# Altium schematic sheet HV Sense.SchDoc
size A4; SheetNumber: 7; SheetTotal: 11
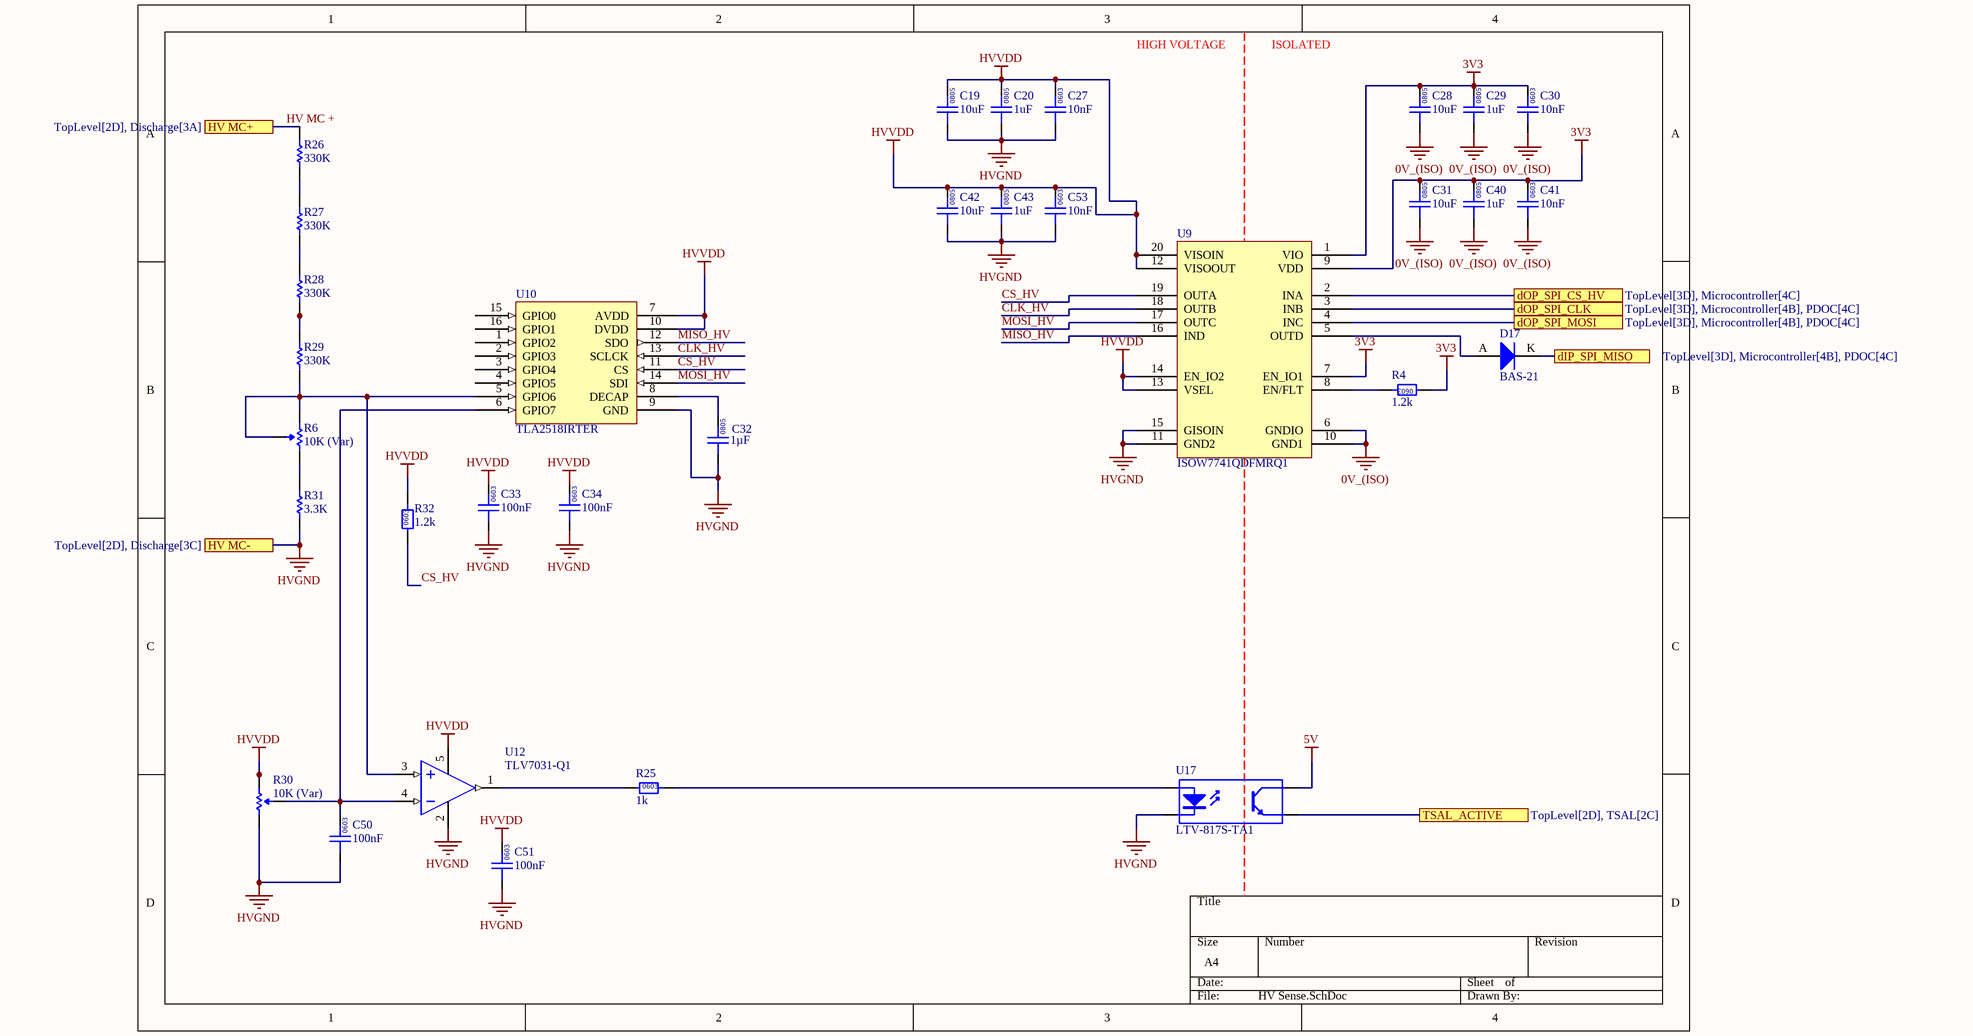
[diagram p0: HV Sense.SchDoc]

## Parts
C19  10uF  [GCM21BR71H105KA03L-Footprint-1]
C20  1uF  [GCM21BR71H105KA03L-Footprint-1]
C27  10nF  [0603 Capacitor]
C28  10uF  [GCM21BR71H105KA03L-Footprint-1]
C29  1uF  [GCM21BR71H105KA03L-Footprint-1]
C30  10nF  [0603 Capacitor]
C31  10uF  [GCM21BR71H105KA03L-Footprint-1]
C32  1µF  [0805]
C33  100nF  [0603]
C34  100nF  [0603]
C40  1uF  [GCM21BR71H105KA03L-Footprint-1]
C41  10nF  [0603 Capacitor]
C42  10uF  [GCM21BR71H105KA03L-Footprint-1]
C43  1uF  [GCM21BR71H105KA03L-Footprint-1]
C50  100nF  [0603]
C51  100nF  [0603]
C53  10nF  [0603 Capacitor]
D17  BAS-21  [NEXPERIA_SOT23]
R4  1.2k  [0603]
R6  10K (Var)  [B 3296]
R25  1k  [0603]
R26  330K  [VB 0207]
R27  330K  [VB 0207]
R28  330K  [VB 0207]
R29  330K  [VB 0207]
R30  10K (Var)  [B 3296]
R31  3.3K  [VB 0207]
R32  1.2k  [0603]
U9  ISOW7741QDFMRQ1  [TI-SOIC-20]
U10  TLA2518IRTER  [QFN50P300X300X80_HS-17N]
U12  TLV7031-Q1  [TI SOT-23-5]
U17  LTV-817S-TA1  [ON 4-SMD]

## Ports
dIP_SPI_MISO (see TopLevel[3D], Microcontroller[4B], PDOC[4C]), dOP_SPI_CLK (see TopLevel[3D], Microcontroller[4B], PDOC[4C]), dOP_SPI_CS_HV (see TopLevel[3D], Microcontroller[4C]), dOP_SPI_MOSI (see TopLevel[3D], Microcontroller[4B], PDOC[4C]), HV MC+ (see TopLevel[2D], Discharge[3A]), HV MC- (see TopLevel[2D], Discharge[3C]), TSAL_ACTIVE (see TopLevel[2D], TSAL[2C])

## Nets
0V_(ISO): C28.1 C29.1 C30.1 C31.1 C40.1 C41.1 U9.6(GNDIO) U9.10(GND1)
3V3: C28.2 C29.2 C30.2 C31.2 C40.2 C41.2 R4.1 U9.1(VIO) U9.7(EN_IO1) U9.9(VDD)
5V: U17.4(C)
HVGND: C19.1 C20.1 C27.1 C32.1 C33.1 C34.1 C42.1 C43.1 C50.1 C51.1 C53.1 R30.3(CW) R31.1 U9.11(GND2) U9.15(GISOIN) U10.9(GND) U12.2(V-) U17.2(K) ; port HV MC-
HVVDD: C19.2 C20.2 C27.2 C33.2 C34.2 C42.2 C43.2 C51.2 C53.2 R30.1(CCW) R32.2 U9.12(VISOOUT) U9.13(VSEL) U9.14(EN_IO2) U9.20(VISOIN) U10.7(AVDD) U10.10(DVDD) U12.5(Vcc)
CLK_HV: U9.18(OUTB) U10.13(SCLCK)
CS_HV: R32.1 U9.19(OUTA) U10.11(CS)
dIP_SPI_MISO: D17.K ; port dIP_SPI_MISO
dOP_SPI_CLK: U9.3(INB) ; port dOP_SPI_CLK
dOP_SPI_CS_HV: U9.2(INA) ; port dOP_SPI_CS_HV
dOP_SPI_MOSI: U9.4(INC) ; port dOP_SPI_MOSI
HV MC +: R26.2 ; port HV MC+
MISO_HV: U9.16(IND) U10.12(SDO)
MOSI_HV: U9.17(OUTC) U10.14(SDI)
TSAL_ACTIVE: U17.3(E) ; port TSAL_ACTIVE
NetC32_2: C32.2 U10.8(DECAP)
NetC50_2: C50.2 R30.2(Wiper) U10.6(GPIO7) U12.4(IN-)
NetD17_A: D17.A U9.5(OUTD)
NetR4_2: R4.2 U9.8(EN/FLT)
NetR6_1: R6.1(CCW) R31.2
NetR6_2: R6.2(Wiper) R6.3(CW) R29.1 U10.5(GPIO6) U12.3(IN+)
NetR25_1: R25.1 U12.1(OUT)
NetR25_2: R25.2 U17.1(A)
NetR26_1: R26.1 R27.2
NetR27_1: R27.1 R28.2
NetR28_1: R28.1 R29.2

Not connected (* = marked no-connect by the designer): U10 1(GPIO2) 2(GPIO3) 3(GPIO4) 4(GPIO5) 15(GPIO0) 16(GPIO1)

## Notes on the sheet
- HIGH VOLTAGE
- ISOLATED
- (in symbol CMP-102-000028-7) 0603
- (in symbol CMP-102-000033-3) 0805
- (in symbol CMP-102-000034-2) 0805
- (in symbol GCM21BR71H105KA03L) 0805
- (in symbol GCM188L81H104KA57D) 0603
- (in symbol RC0603FR-071KL) 0603
- (in symbol RC0603JR-071K2L) 0603

## Library data of the parts
C19 C28 C31 C42 = CMP-102-000034-2: Ceramic Capacitor, Multilayer, Ceramic, 35V, 10% +Tol, 10% -Tol, X5R, 15% TC, 10uF, Surface Mount, 0805; Part Number: GRM21BR6YA106KE43L; Value: 10µF; Material: X7R; Tolerance: 10%; Rated Voltage: 35V; Digikey Link: https://www.digikey.com.au/en/products/detail/murata-electronics/GRM21BR6YA106KE43L/5027598?s=N4IgTCBcDaIOICUCyYCMAhBA2AmgQVQAYsBpAUQBYBmAGQAIQBdAXyA
C20 C29 C40 C43 = CMP-102-000033-3: Ceramic Capacitor, Multilayer, Ceramic, 50V, 10% +Tol, 10% -Tol, X7R, 15% TC, 1uF, Surface Mount, 0805; Part Number: GCM21BR71H105KA03L; Value: 1µF; Rated Voltage: 50V; Digikey Link: https://www.digikey.com.au/en/products/detail/murata-electronics/GCM21BR71H105KA03L/4903984?s=N4IgTCBcDaIOIGECyYCMAhASgdlQCVQAYBWAaQEFCBmAGRAF0BfIA; Tolerance: 10%; Material: X7R
C27 C30 C41 C53 = CMP-102-000028-7: Ceramic Capacitor, Multilayer, Ceramic, 50V, 5% +Tol, 5% -Tol, C0G, 30ppm/Cel TC, 0.01uF, Surface Mount, 0603; Part Number: GCM1885C1H103JA16D; Value: 10nF; Material: C0G; Rated Voltage: 50V; Tolerance: 5%; Digikey Link: https://www.digikey.com.au/en/products/detail/murata-electronics/GCM1885C1H103JA16D/13401923?s=N4IgTCBcDaIOIGECyBGAHGgrAlAJFADAMwBSAgigGwAiIAugL5A
C32 = GCM21BR71H105KA03L: Manufacturer: muRata; Rated Voltage: 50V; Tolerance: ±10%; Material: MLCC; Temperature Rating: X7R; Part Number: GCM21BR71H105KA03L; Value: 1µF; Digikey Part Number: 490-10675-1-ND
C33 C34 C50 C51 = GCM188L81H104KA57D: Manufacturer: muRata; Rated Voltage: 50V; Tolerance: ±10%; Material: MLCC; Temperature Rating: X8L; Part Number: GCM188L81H104KA57D; Value: 100nF; Digikey Part Number: 490-6049-1-ND
D17 = BAS-21: Manufacturer: Nexperia USA Inc.; Forward Voltage: 1.0V; Breakdown Voltage: 250V; Rated Power: 250mW; Part Number: BAS-21
R4 R32 = RC0603JR-071K2L: Manufacturer: YAGEO; Tolerance: 0.01; Rated Power: 0.1W; Part Number: RC0603JR-071K2L; Value: 1.2k; Material: FR-07; Digikey Part Number: 311-1.2KGRCT-ND
R6 R30 = 3296W-1-103LF: Manufacturer: Bournes Inc; Tolerance: 0.1; Rated Power: 0.5W; Part Number: 3296W-1-103LF; Value: 10K (Var); Digikey Part Number: 3296W-103LF-ND
R25 = RC0603FR-071KL: Manufacturer: YAGEO; Tolerance: 0.01; Rated Power: 0.1W; Part Number: RC0603FR-071KL; Value: 1k; Digikey Part Number: 311-1.00KHRCT-ND; Material: FR-07
R26-R29 = MMB02070C3303FB200: Manufacturer: Vishay Beyschlag; Tolerance: 0.01; Rated Power: 1W; Part Number: MMB02070C3303FB200; Value: 330K; Digikey Part Number: MMB-330KBCT-ND
R31 = MMB02070C3301FB200: Manufacturer: Vishay Beyschlag; Tolerance: 0.01; Rated Voltage: 1W; Part Number: MMB02070C3301FB200; Value: 3.3K; Digikey Part Number: MMB-3.30KBCT-ND
U9 = CMP-001-0030-1: Automotive, low-emissions, quad-channel 3/1 reinforced digital isolator with integrated power 20-SOIC -40 to 125
U10 = CMP-001-0002-15: 8-Channel Single ADC SAR 1Msps 12-bit Serial 16-Pin WQFN EP T/R; Digikey Link: https://www.digikey.com.au/en/products/detail/texas-instruments/ADS7028IRTER/12696020?s=N4IgTCBcDaIIIBEDKB2ADGAHASQEoBUBRXEAXQF8g
U12 = TLV7031-Q1: Manufacturer: Texas Instruments; Input Voltage: 1.6 to 6.5 V; Channels: 1; Output: Push-Pull; Part Number: TLV7031-Q1; Digikey Part Number: 296-TLV7031QDBVRQ1CT-ND
U17 = LTV-817S-TA1: 35V 50ma Optocoupler (VF=1.2V); Manufacturer: Lite-On Inc; Part Number: LTV-817S-TA1; Digikey Part Number: 160-1893-2-ND; Digikey Link: https://www.digikey.com/product-detail/en/lite-on-inc/LTV-817S-TA1/160-1893-2-ND/388451